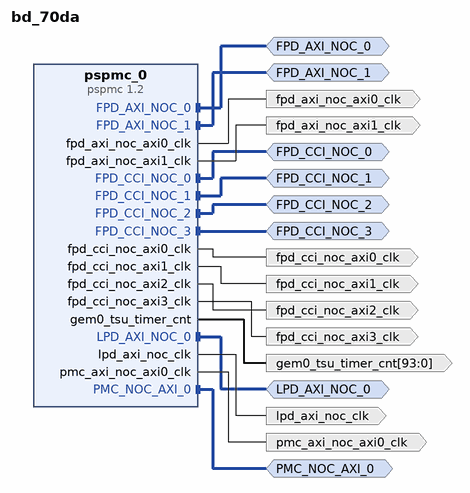
[diagram p0: block diagram of the top level]
# Vivado block design bd_70da, xcvc1902-vsva2197-2MP-e-S, Vivado 2022.1
create_bd_design bd_70da

create_bd_intf_port -mode Master -vlnv xilinx.com:interface:aximm_rtl:1.0 FPD_CCI_NOC_0
set_property -dict {CONFIG.FREQ_HZ 824999207 CONFIG.INDEX 0} [get_bd_intf_ports FPD_CCI_NOC_0]
create_bd_intf_port -mode Master -vlnv xilinx.com:interface:aximm_rtl:1.0 FPD_CCI_NOC_1
set_property -dict {CONFIG.FREQ_HZ 824999207 CONFIG.INDEX 1} [get_bd_intf_ports FPD_CCI_NOC_1]
create_bd_intf_port -mode Master -vlnv xilinx.com:interface:aximm_rtl:1.0 FPD_CCI_NOC_2
set_property -dict {CONFIG.FREQ_HZ 824999207 CONFIG.INDEX 2} [get_bd_intf_ports FPD_CCI_NOC_2]
create_bd_intf_port -mode Master -vlnv xilinx.com:interface:aximm_rtl:1.0 FPD_CCI_NOC_3
set_property -dict {CONFIG.FREQ_HZ 824999207 CONFIG.INDEX 3} [get_bd_intf_ports FPD_CCI_NOC_3]
create_bd_intf_port -mode Master -vlnv xilinx.com:interface:aximm_rtl:1.0 FPD_AXI_NOC_0
set_property -dict {CONFIG.FREQ_HZ 824999207 CONFIG.INDEX 0} [get_bd_intf_ports FPD_AXI_NOC_0]
create_bd_intf_port -mode Master -vlnv xilinx.com:interface:aximm_rtl:1.0 FPD_AXI_NOC_1
set_property -dict {CONFIG.FREQ_HZ 824999207 CONFIG.INDEX 1} [get_bd_intf_ports FPD_AXI_NOC_1]
create_bd_intf_port -mode Master -vlnv xilinx.com:interface:aximm_rtl:1.0 LPD_AXI_NOC_0
set_property -dict {CONFIG.FREQ_HZ 591666077 CONFIG.INDEX 0} [get_bd_intf_ports LPD_AXI_NOC_0]
create_bd_intf_port -mode Master -vlnv xilinx.com:interface:aximm_rtl:1.0 PMC_NOC_AXI_0
set_property -dict {CONFIG.FREQ_HZ 400000000 CONFIG.INDEX 0 CONFIG.SLR_INDEX 0} [get_bd_intf_ports PMC_NOC_AXI_0]
create_bd_port -dir O -type clk fpd_cci_noc_axi0_clk
set_property -dict {CONFIG.FREQ_HZ 824999207} [get_bd_ports fpd_cci_noc_axi0_clk]
create_bd_port -dir O -type clk fpd_cci_noc_axi1_clk
set_property -dict {CONFIG.FREQ_HZ 824999207} [get_bd_ports fpd_cci_noc_axi1_clk]
create_bd_port -dir O -type clk fpd_cci_noc_axi2_clk
set_property -dict {CONFIG.FREQ_HZ 824999207} [get_bd_ports fpd_cci_noc_axi2_clk]
create_bd_port -dir O -type clk fpd_cci_noc_axi3_clk
set_property -dict {CONFIG.FREQ_HZ 824999207} [get_bd_ports fpd_cci_noc_axi3_clk]
create_bd_port -dir O -type clk fpd_axi_noc_axi0_clk
set_property -dict {CONFIG.FREQ_HZ 824999207} [get_bd_ports fpd_axi_noc_axi0_clk]
create_bd_port -dir O -type clk fpd_axi_noc_axi1_clk
set_property -dict {CONFIG.FREQ_HZ 824999207} [get_bd_ports fpd_axi_noc_axi1_clk]
create_bd_port -dir O -type clk lpd_axi_noc_clk
set_property -dict {CONFIG.FREQ_HZ 591666077} [get_bd_ports lpd_axi_noc_clk]
create_bd_port -dir O -type clk pmc_axi_noc_axi0_clk
set_property -dict {CONFIG.FREQ_HZ 400000000} [get_bd_ports pmc_axi_noc_axi0_clk]
create_bd_port -dir O -from 93 -to 0 gem0_tsu_timer_cnt

create_bd_cell -type ip -vlnv xilinx.com:ip:pspmc:1.2 pspmc_0
